# EAGLE design ADAPTER (EAGLE 6.5.0)
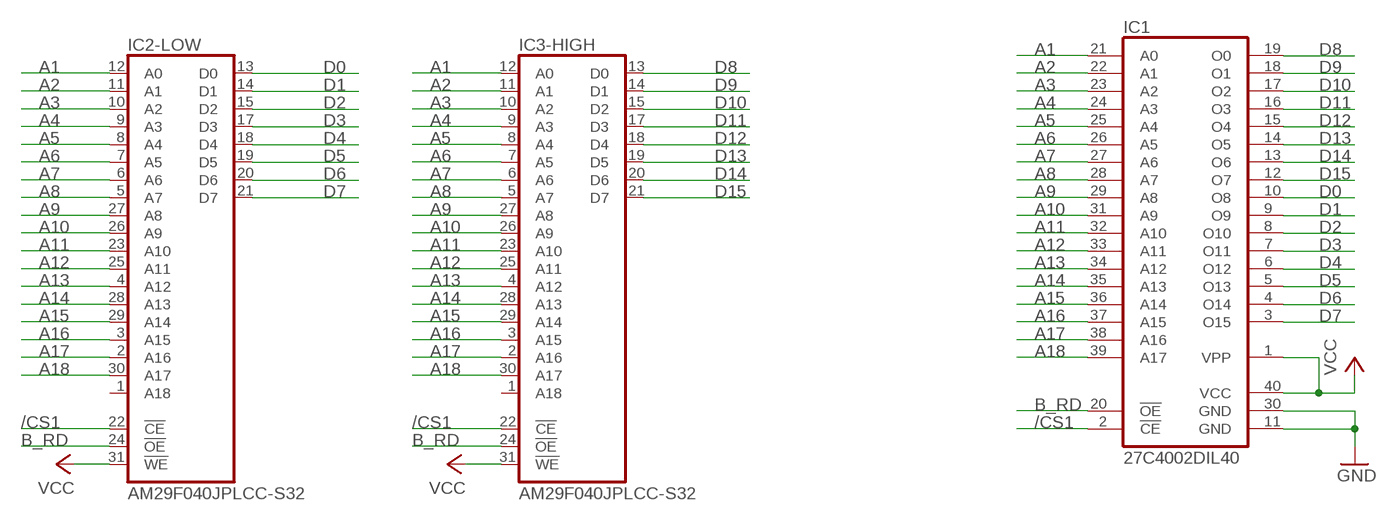
[diagram p0: schematic, sheet 1]

## Parts
IC1  27C4002DIL40  [DIL40]
IC2-LOW  AM29F040JPLCC-S32  [PLCC-S32]
IC3-HIGH  AM29F040JPLCC-S32  [PLCC-S32]

## Nets
/CS1: IC1.2(!CE) IC2-LOW.22(!CE) IC3-HIGH.22(!CE)
A1: IC1.21(A0) IC2-LOW.12(A0) IC3-HIGH.12(A0)
A2: IC1.22(A1) IC2-LOW.11(A1) IC3-HIGH.11(A1)
A3: IC1.23(A2) IC2-LOW.10(A2) IC3-HIGH.10(A2)
A4: IC1.24(A3) IC2-LOW.9(A3) IC3-HIGH.9(A3)
A5: IC1.25(A4) IC2-LOW.8(A4) IC3-HIGH.8(A4)
A6: IC1.26(A5) IC2-LOW.7(A5) IC3-HIGH.7(A5)
A7: IC1.27(A6) IC2-LOW.6(A6) IC3-HIGH.6(A6)
A8: IC1.28(A7) IC2-LOW.5(A7) IC3-HIGH.5(A7)
A9: IC1.29(A8) IC2-LOW.27(A8) IC3-HIGH.27(A8)
A10: IC1.31(A9) IC2-LOW.26(A9) IC3-HIGH.26(A9)
A11: IC1.32(A10) IC2-LOW.23(A10) IC3-HIGH.23(A10)
A12: IC1.33(A11) IC2-LOW.25(A11) IC3-HIGH.25(A11)
A13: IC1.34(A12) IC2-LOW.4(A12) IC3-HIGH.4(A12)
A14: IC1.35(A13) IC2-LOW.28(A13) IC3-HIGH.28(A13)
A15: IC1.36(A14) IC2-LOW.29(A14) IC3-HIGH.29(A14)
A16: IC1.37(A15) IC2-LOW.3(A15) IC3-HIGH.3(A15)
A17: IC1.38(A16) IC2-LOW.2(A16) IC3-HIGH.2(A16)
A18: IC1.39(A17) IC2-LOW.30(A17) IC3-HIGH.30(A17)
B_RD: IC1.20(!OE) IC2-LOW.24(!OE) IC3-HIGH.24(!OE)
D0: IC1.10(O8) IC2-LOW.13(D0)
D1: IC1.9(O9) IC2-LOW.14(D1)
D2: IC1.8(O10) IC2-LOW.15(D2)
D3: IC1.7(O11) IC2-LOW.17(D3)
D4: IC1.6(O12) IC2-LOW.18(D4)
D5: IC1.5(O13) IC2-LOW.19(D5)
D6: IC1.4(O14) IC2-LOW.20(D6)
D7: IC1.3(O15) IC2-LOW.21(D7)
D8: IC1.19(O0) IC3-HIGH.13(D0)
D9: IC1.18(O1) IC3-HIGH.14(D1)
D10: IC1.17(O2) IC3-HIGH.15(D2)
D11: IC1.16(O3) IC3-HIGH.17(D3)
D12: IC1.15(O4) IC3-HIGH.18(D4)
D13: IC1.14(O5) IC3-HIGH.19(D5)
D14: IC1.13(O6) IC3-HIGH.20(D6)
D15: IC1.12(O7) IC3-HIGH.21(D7)
GND: IC1.11(GND) IC1.30(GND)
VCC: IC1.1(VPP) IC1.40(VCC) IC2-LOW.31(!WE) IC3-HIGH.31(!WE)
Unconnected: IC2-LOW.1(A18) IC3-HIGH.1(A18)

## Power pins joined to a net without a drawn wire
GND: IC2-LOW.16(GND) IC3-HIGH.16(GND)
VCC: IC2-LOW.32(VCC) IC3-HIGH.32(VCC)

## Library data of the parts
IC1 = memory-nec:27C4002
IC2-LOW IC3-HIGH = am29-memory:AM29F040J: 4-Megabit FLASH MEMORY (512 K x 8 bit) 5 V-only

## Board
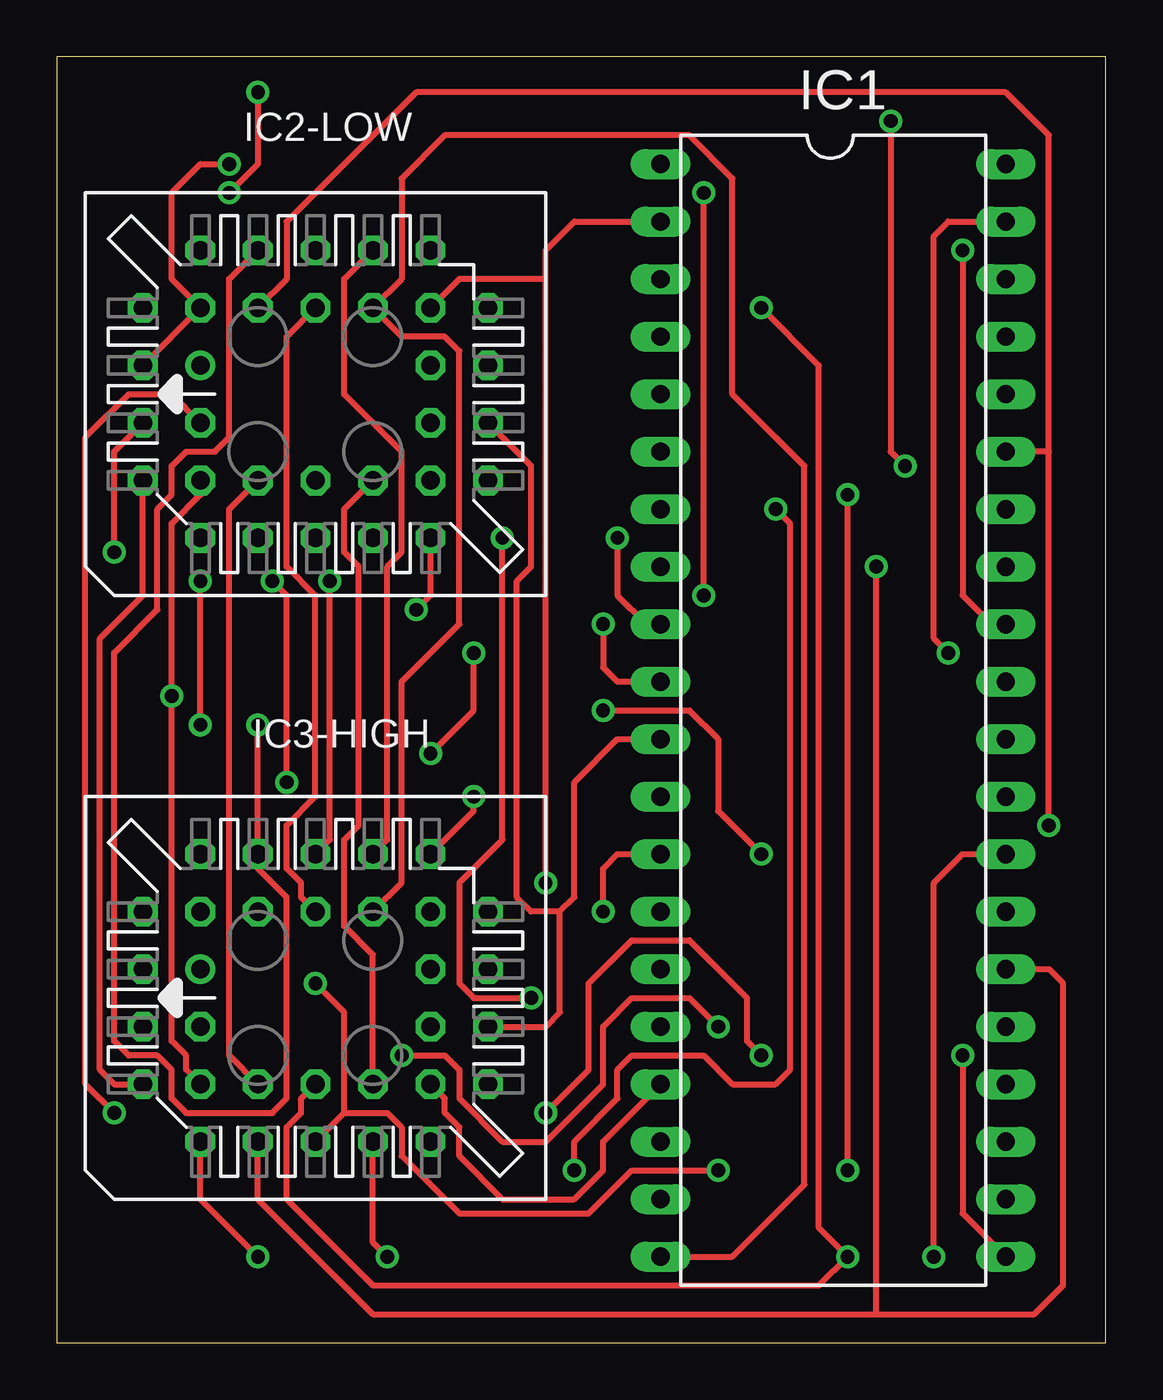
[diagram p1: board, top side]
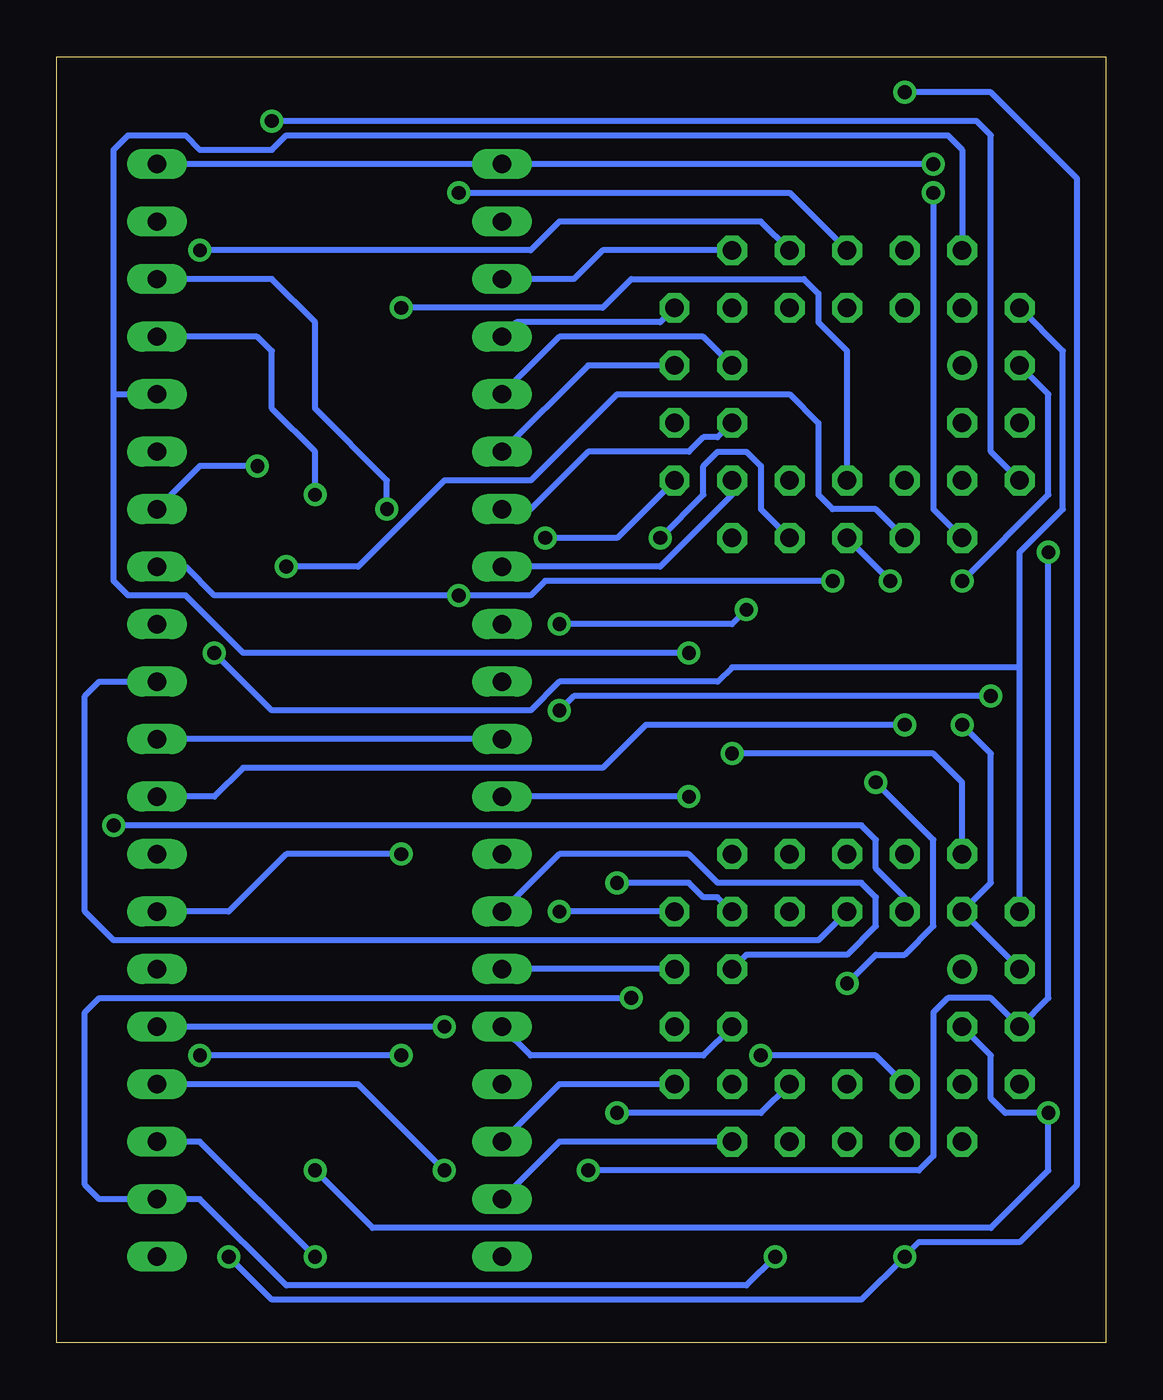
[diagram p2: board, bottom side, seen from below]

Size 46.34 x 56.82 mm. Coordinates in mm from the lower left corner, seen from the top.
Outline: 0,0 46.34,0 46.34,56.82 0,56.82 0,0
Copper layers (1*16): Top 0.035mm / dielectric 1.5mm / Bottom 0.035mm
Design rules "default": minimum track width 10mil, minimum drill 24mil, track to track 8mil, track to pad 8mil, pad to pad 8mil, via to via 8mil, smd to smd 8mil, copper to edge 40mil, drill to drill 8mil, minimum pad ring 10mil, minimum via ring 8mil, stop-mask expansion 4mil, vias tented up to drill 0mil, thermal gap 10mil

### Footprints (pad centres in the part's own frame; a part is rotated, then mirrored left to right if it is on the bottom)
DIL40 = drill 0.813 long: 1 -24.13,-7.62; 2 -21.59,-7.62; 3 -19.05,-7.62; 4 -16.51,-7.62; 5 -13.97,-7.62; 6 -11.43,-7.62; 7 -8.89,-7.62; 8 -6.35,-7.62; 9 -3.81,-7.62; 10 -1.27,-7.62; 11 1.27,-7.62; 12 3.81,-7.62; 13 6.35,-7.62; 14 8.89,-7.62; 15 11.43,-7.62; 16 13.97,-7.62; 17 16.51,-7.62; 18 19.05,-7.62; 19 21.59,-7.62; 20 24.13,-7.62; 21 24.13,7.62; 22 21.59,7.62; 23 19.05,7.62; 24 16.51,7.62; 25 13.97,7.62; 26 11.43,7.62; 27 8.89,7.62; 28 6.35,7.62; 29 3.81,7.62; 30 1.27,7.62; 31 -1.27,7.62; 32 -3.81,7.62; 33 -6.35,7.62; 34 -8.89,7.62; 35 -11.43,7.62; 36 -13.97,7.62; 37 -16.51,7.62; 38 -19.05,7.62; 39 -21.59,7.62; 40 -24.13,7.62
PLCC-S32 = drill 0.813: 1 1.27,5.08 | drill 0.813 octagon: 2 -1.27,7.62; 3 -1.27,5.08; 4 -3.81,7.62; 5 -6.35,5.08; 6 -3.81,5.08; 7 -6.35,2.54; 8 -3.81,2.54; 9 -6.35,0; 10 -3.81,0; 11 -6.35,-2.54; 12 -3.81,-2.54; 13 -6.35,-5.08; 14 -3.81,-7.62; 15 -3.81,-5.08; 16 -1.27,-7.62; 17 -1.27,-5.08; 18 1.27,-7.62; 19 1.27,-5.08; 20 3.81,-7.62; 21 6.35,-5.08; 22 3.81,-5.08; 23 6.35,-2.54; 24 3.81,-2.54; 25 6.35,0; 26 3.81,0; 27 6.35,2.54; 28 3.81,2.54; 29 6.35,5.08; 30 3.81,7.62; 31 3.81,5.08; 32 1.27,7.62

### Placement (x,y rotation side)
IC1  34.29,27.94 270 top
IC2-LOW  11.43,41.91 90 top
IC3-HIGH  11.43,15.24 90 top

### Tracks (layer width: path | path; a pad name or v marks a point on that pad's centre or on a via)
/CS1  (via drill 0.61)
  Top 0.254: v21.59,20.32 21.59,46.99 | 21.59,46.99 21.59,48.26 22.86,49.53 IC1.2 | IC2-LOW.22 17.78,46.99 21.59,46.99
  Bottom 0.254: IC3-HIGH.22 17.14,19.68 17.78,19.68 18.41,20.32 v21.59,20.32
A1  (via drill 0.61)
  Top 0.254: IC3-HIGH.12 13.97,17.14 12.7,18.41 12.7,22.23 13.34,22.86 13.34,34.29 12.7,34.92 12.7,36.83 IC2-LOW.12 | IC1.21 40.01,5.71 v40.01,12.7 | v31.11,12.7 30.48,13.34 30.48,15.24 27.94,17.78 25.4,17.78 23.5,15.88 23.5,12.06 v21.59,10.16
  Bottom 0.254: v31.11,12.7 v40.01,12.7 | v21.59,10.16 15.24,10.16 IC3-HIGH.12
A2  (via drill 0.61)
  Top 0.254: IC3-HIGH.11 13.97,4.45 v14.61,3.81 | v19.68,35.56 19.68,22.23 17.78,20.32 17.78,15.88 18.41,15.24 v20.95,15.24
  Bottom 0.254: v14.61,3.81 15.88,2.54 36.2,2.54 40.01,6.35 IC1.22 44.45,6.35 45.09,6.99 45.09,14.61 44.45,15.24 v20.95,15.24 | IC2-LOW.11 15.24,36.83 15.24,38.73 15.88,39.37 17.14,39.37 17.78,38.73 17.78,37.47 v19.68,35.56
A3  (via drill 0.61)
  Top 0.254: IC3-HIGH.10 10.79,10.79 10.79,10.16 10.16,9.53 10.16,6.35 13.97,2.54 33.66,2.54 v34.92,3.81 33.66,5.08 33.66,43.18 v31.11,45.72
  Bottom 0.254: v34.92,3.81 40.01,8.89 IC1.23 | v31.11,45.72 22.23,45.72 20.95,46.99 13.34,46.99 12.7,46.35 12.7,45.09 11.43,43.81 IC2-LOW.10
A4  (via drill 0.61)
  Top 0.254: IC3-HIGH.9 12.7,10.16 | 12.7,10.16 14.61,10.16 15.24,9.53 15.24,8.26 17.78,5.71 23.5,5.71 25.4,7.62 v29.21,7.62 | v9.53,33.66 10.16,33.02 v10.16,24.77 | v11.43,15.88 12.7,14.61 12.7,10.16
  Bottom 0.254: v29.21,7.62 33.02,11.43 IC1.24 | v9.53,33.66 IC2-LOW.9 | v10.16,24.77 7.62,22.23 7.62,18.41 8.89,17.14 10.16,17.14 v11.43,15.88
A5  (via drill 0.61)
  Top 0.254: IC3-HIGH.8 7.62,12.7 7.62,36.83 IC2-LOW.8 | v29.21,13.97 27.94,15.24 25.4,15.24 24.13,13.97 24.13,11.43 21.59,8.89 19.68,8.89 17.78,10.79 17.78,12.06 17.14,12.7 v15.24,12.7
  Bottom 0.254: v29.21,13.97 IC1.25 | v15.24,12.7 10.16,12.7 IC3-HIGH.8
A6  (via drill 0.61)
  Top 0.254: IC3-HIGH.7 8.89,6.35 13.97,1.27 36.2,1.27 | IC1.26 43.81,16.51 44.45,15.88 44.45,2.54 43.18,1.27 36.2,1.27 | 36.2,1.27 v36.2,34.29
  Bottom 0.254: IC2-LOW.7 10.16,36.83 12.06,36.83 12.7,37.47 12.7,40.64 13.97,41.91 21.59,41.91 25.4,38.1 29.21,38.1 33.02,34.29 v36.2,34.29
A7  (via drill 0.61)
  Top 0.254: IC3-HIGH.6 5.71,12.06 5.71,12.7 5.08,13.34 v5.08,28.57 5.08,36.2 6.35,37.47 IC2-LOW.6 | v31.11,21.59 29.21,23.5 29.21,26.67 27.94,27.94 v24.13,27.94
  Bottom 0.254: IC1.27 38.73,19.05 36.2,21.59 v31.11,21.59 | v24.13,27.94 23.5,28.57 v5.08,28.57
A8  (via drill 0.61)
  Top 0.254: IC3-HIGH.5 6.35,6.35 v8.89,3.81 | v38.73,3.81 38.73,20.32 40.01,21.59 IC1.28 | v7.62,50.8 8.89,52.07 v8.89,55.24
  Bottom 0.254: v38.73,3.81 36.83,1.91 10.79,1.91 v8.89,3.81 8.26,4.45 3.81,4.45 1.27,6.99 1.27,51.44 5.08,55.24 v8.89,55.24 | IC2-LOW.5 7.62,36.83 v7.62,50.8
A9  (via drill 0.61)
  Top 0.254: v8.89,27.3 IC3-HIGH.27 8.89,20.95 10.16,19.68 10.16,10.79 9.53,10.16 5.71,10.16 5.08,10.79 5.08,12.06 4.45,12.7 3.17,12.7 2.54,13.34 2.54,30.48 4.45,32.38 4.45,36.83 5.08,37.47 5.08,38.73 5.71,39.37 6.99,39.37 7.62,40.01 7.62,46.99 IC2-LOW.27
  Bottom 0.254: v8.89,27.3 20.32,27.3 22.23,25.4 38.1,25.4 39.37,24.13 IC1.29
A10
  Top 0.254: IC3-HIGH.26 10.79,19.68 10.79,20.32 10.16,20.95 10.16,22.86 11.43,24.13 11.43,33.02 10.16,34.29 10.16,44.45 IC2-LOW.26
  Bottom 0.254: IC1.31 44.45,29.21 45.09,28.57 45.09,19.05 43.81,17.78 12.7,17.78 IC3-HIGH.26
A11  (via drill 0.61)
  Top 0.254: IC3-HIGH.23 14.61,22.23 14.61,34.29 15.24,34.92 15.24,39.37 12.7,41.91 12.7,46.99 IC2-LOW.23 | IC1.32 41.27,31.75 40.01,33.02 v40.01,48.26
  Bottom 0.254: v40.01,48.26 25.4,48.26 24.13,49.53 15.24,49.53 IC2-LOW.23
A12  (via drill 0.61)
  Top 0.254: IC3-HIGH.25 12.06,22.23 v12.06,33.66 | v28.57,33.02 v28.57,50.8
  Bottom 0.254: v12.06,33.66 24.77,33.66 25.4,33.02 v28.57,33.02 39.37,33.02 40.64,34.29 IC1.33 | IC2-LOW.25 13.97,50.8 v28.57,50.8
A13  (via drill 0.61)
  Top 0.254: IC3-HIGH.4 2.54,11.43 1.91,12.06 1.91,31.11 3.81,33.02 IC2-LOW.4 | v37.47,38.73 36.83,39.37 v36.83,53.98
  Bottom 0.254: IC1.34 40.01,38.73 v37.47,38.73 | v36.83,53.98 5.71,53.98 5.08,53.34 5.08,39.37 IC2-LOW.4
A14  (via drill 0.61)
  Top 0.254: v43.81,22.86 43.81,39.37 | 43.81,39.37 IC1.35 | IC2-LOW.28 10.16,46.99 10.16,49.53 15.88,55.24 41.91,55.24 43.81,53.34 43.81,39.37
  Bottom 0.254: v43.81,22.86 10.79,22.86 10.16,22.23 10.16,20.95 8.89,19.68 IC3-HIGH.28
A15  (via drill 0.61)
  Top 0.254: v16.51,26.04 18.41,27.94 v18.41,30.48
  Bottom 0.254: IC3-HIGH.29 6.35,24.77 7.62,26.04 v16.51,26.04 | v18.41,30.48 38.1,30.48 40.64,33.02 43.18,33.02 43.81,33.66 43.81,41.91 | 43.81,41.91 IC1.36 | 43.81,41.91 43.81,52.7 43.18,53.34 40.64,53.34 40.01,52.7 36.83,52.7 36.2,53.34 6.99,53.34 6.35,52.7 IC2-LOW.29
A16  (via drill 0.61)
  Top 0.254: v2.54,10.16 1.27,11.43 1.27,40.01 3.17,41.91 5.08,41.91 IC2-LOW.3 | v34.92,7.62 v34.92,37.47
  Bottom 0.254: v34.92,37.47 34.92,39.37 36.83,41.27 36.83,43.81 37.47,44.45 IC1.37 | v34.92,7.62 32.38,5.08 5.08,5.08 2.54,7.62 v2.54,10.16 4.45,10.16 5.08,10.79 5.08,12.7 IC3-HIGH.3
A17  (via drill 0.61)
  Top 0.254: v2.54,34.92 2.54,39.37 IC2-LOW.2 | v31.75,36.83 32.38,36.2 32.38,12.06 31.75,11.43 29.84,11.43 28.57,12.7 25.4,12.7 24.77,12.06 24.77,10.79 22.86,8.89 v22.86,7.62
  Bottom 0.254: v2.54,34.92 2.54,15.24 IC3-HIGH.2 5.08,15.24 6.99,15.24 7.62,14.61 7.62,8.26 8.26,7.62 v22.86,7.62 | v31.75,36.83 31.75,38.1 34.92,41.27 34.92,45.09 36.83,46.99 IC1.38
A18  (via drill 0.61)
  Top 0.254: v39.37,30.48 38.73,31.11 38.73,48.9 39.37,49.53 IC1.39
  Bottom 0.254: 3.81,29.84 3.81,34.92 1.91,36.83 1.91,43.81 IC2-LOW.30 | IC3-HIGH.30 3.81,29.84 | v39.37,30.48 36.83,27.94 25.4,27.94 24.13,29.21 17.14,29.21 16.51,29.84 3.81,29.84
B_RD
  Top 0.254: IC3-HIGH.24 15.24,20.32 15.24,29.21 17.78,31.75 17.78,43.81 17.14,44.45 15.24,44.45 IC2-LOW.24 15.24,46.99 15.24,51.44 17.14,53.34 27.94,53.34 29.84,51.44 29.84,41.91 33.02,38.73 33.02,6.99 29.84,3.81 IC1.20
D0  (via drill 0.61)
  Top 0.254: IC2-LOW.13 16.51,33.02 v15.88,32.38 | v24.13,31.75 24.13,29.84 24.77,29.21 IC1.10
  Bottom 0.254: v15.88,32.38 16.51,31.75 v24.13,31.75
D1  (via drill 0.61)
  Top 0.254: v24.77,35.56 24.77,33.02 26.04,31.75 IC1.9
  Bottom 0.254: IC2-LOW.14 21.59,35.56 v24.77,35.56
D2
  Bottom 0.254: IC1.8 19.68,34.29 16.51,37.47 IC2-LOW.15
D3
  Bottom 0.254: IC2-LOW.17 17.14,40.01 17.78,40.01 18.41,39.37 22.86,39.37 25.4,36.83 IC1.7
D4
  Bottom 0.254: IC1.6 22.86,43.18 IC2-LOW.18
D5
  Bottom 0.254: IC1.5 24.13,44.45 17.78,44.45 IC2-LOW.19
D6
  Bottom 0.254: IC2-LOW.20 19.68,45.09 26.04,45.09 IC1.4
D7
  Bottom 0.254: IC2-LOW.21 22.23,48.26 23.5,46.99 IC1.3
D8
  Bottom 0.254: IC3-HIGH.13 24.13,8.89 IC1.19
D9
  Bottom 0.254: IC1.18 24.13,11.43 IC3-HIGH.14
D10
  Top 0.254: IC3-HIGH.15 17.14,10.79 17.14,10.16 17.78,9.53 17.78,8.26 19.68,6.35 22.86,6.35 24.13,7.62 24.13,8.89 IC1.17
D11
  Bottom 0.254: IC3-HIGH.17 17.78,12.7 25.4,12.7 IC1.16
D12
  Bottom 0.254: IC3-HIGH.18 IC1.15
D13
  Bottom 0.254: IC3-HIGH.19 15.88,17.14 11.43,17.14 10.16,18.41 10.16,19.68 10.79,20.32 17.14,20.32 18.41,21.59 24.13,21.59 IC1.14
D14  (via drill 0.61)
  Top 0.254: v24.13,19.05 24.13,20.95 24.77,21.59 IC1.13
  Bottom 0.254: IC3-HIGH.20 v24.13,19.05
D15  (via drill 0.61)
  Top 0.254: IC3-HIGH.21 18.41,23.5 v18.41,24.13
  Bottom 0.254: v18.41,24.13 IC1.12
GND
  Top 0.254: IC1.11 24.77,26.67 22.86,24.77 22.86,19.68 22.23,19.05 | IC2-LOW.16 20.95,38.73 20.95,34.29 20.32,33.66 20.32,19.68 20.95,19.05 22.23,19.05 | IC3-HIGH.16 21.59,13.97 22.23,14.61 22.23,19.05
  Bottom 0.254: IC1.11 IC1.30
VCC  (via drill 0.61)
  Top 0.254: IC2-LOW.32 IC2-LOW.31 5.08,46.99 5.08,49.53 5.08,50.8 6.35,52.07 v7.62,52.07 | v6.35,27.3 v6.35,33.66
  Bottom 0.254: IC1.40 IC1.1 v7.62,52.07 | IC3-HIGH.32 IC3-HIGH.31 5.08,20.32 5.08,26.04 v6.35,27.3 | v6.35,33.66 2.54,37.47 2.54,41.91 IC2-LOW.32